# EAGLE design PIC18 DEV BOARD (EAGLE 8.0.1)
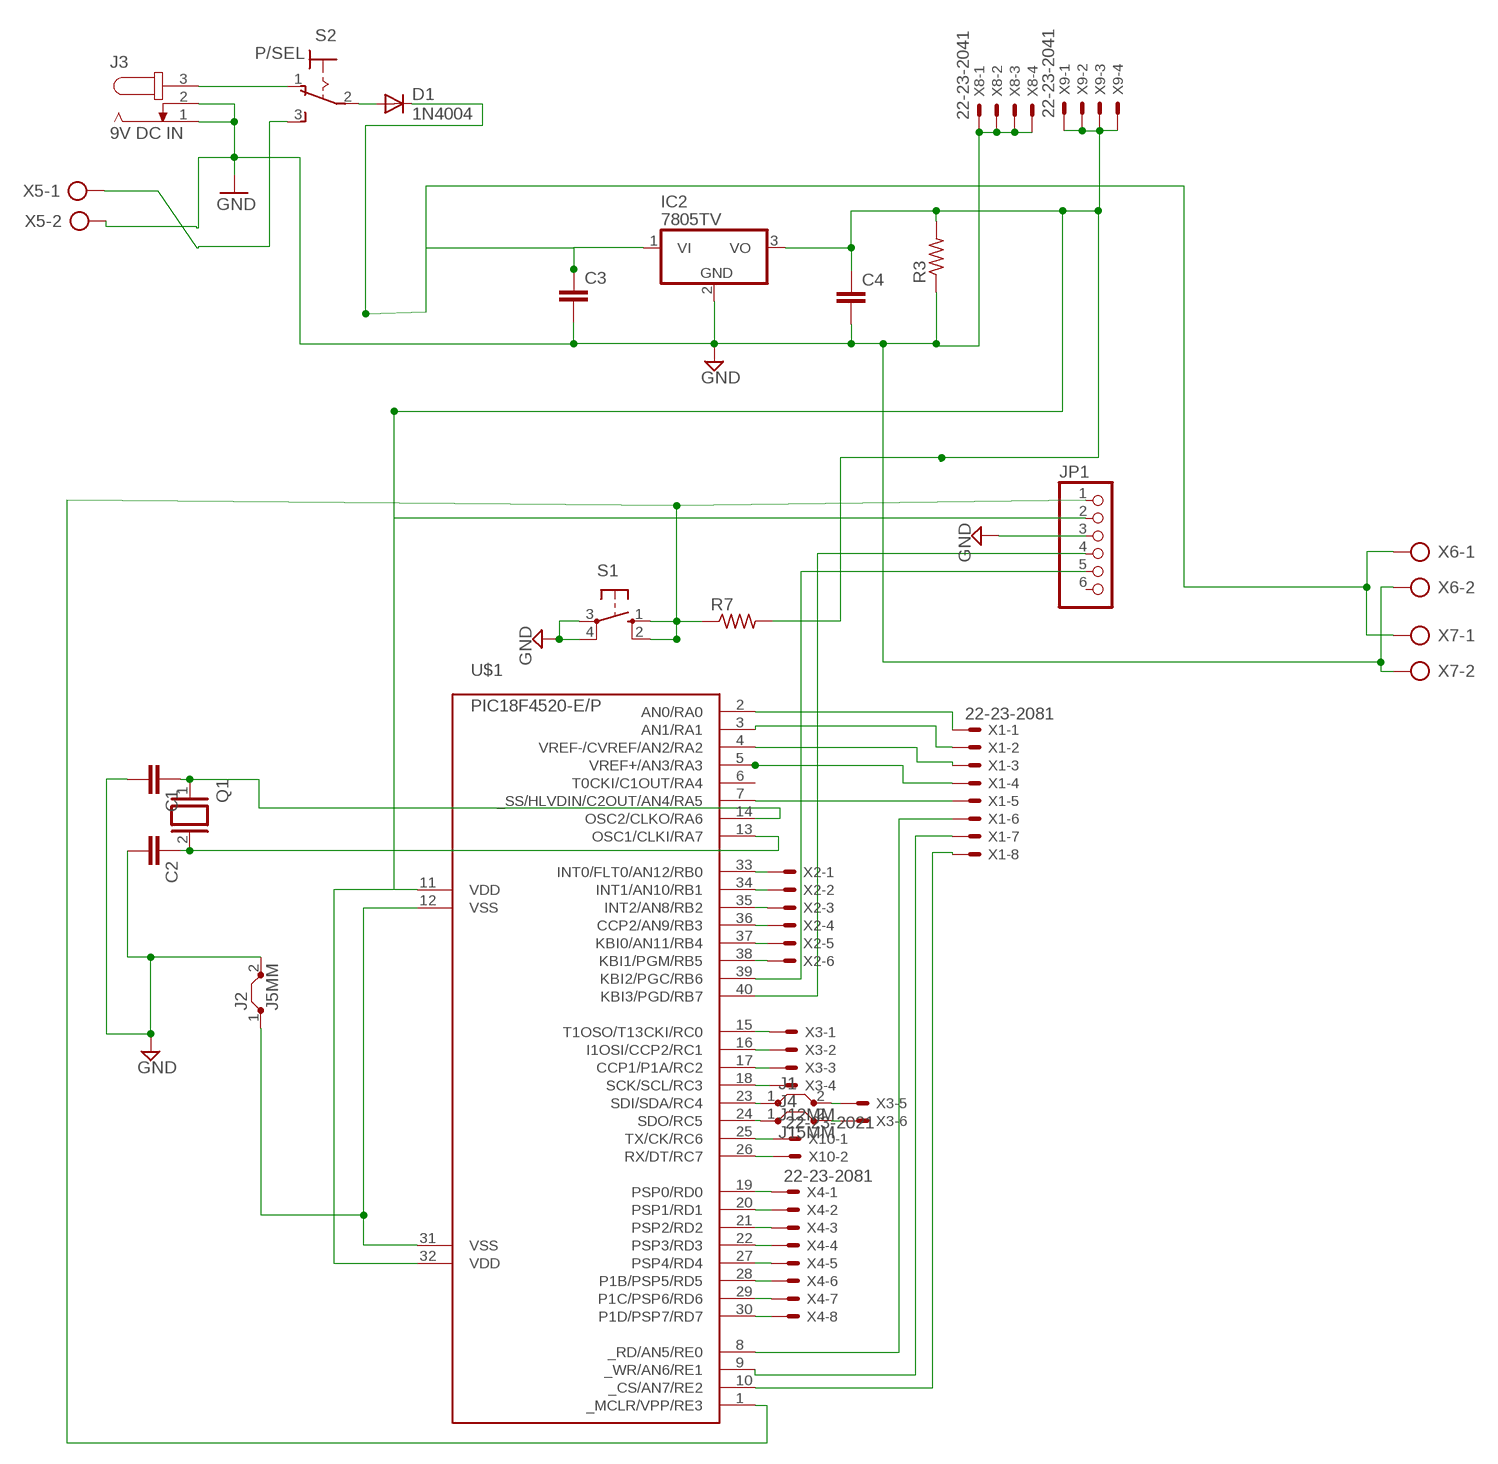
[diagram p0: schematic, sheet 1]

## Parts
C1  C-EU025-025X050  [C025-025X050]
C2  C-EU025-025X050  [C025-025X050]
C3  C-EU025-025X050  [C025-025X050]
C4  C-EU025-025X050  [C025-025X050]
D1  1N4004  [DO41-10]
IC2  7805TV  [TO220V]
J1  J12MM  [12]
J2  J5MM  [05]
J3  9V DC IN  JACK-PLUG0  [SPC4077]
J4  J15MM  [15]
JP1  PINHD-1X6  [1X06]
Q1  XTAL/S  [QS]
R3  R-US_0207/10  [0207/10]
R7  R-US_0207/10  [0207/10]
S1  10-XX  [B3F-10XX]
S2  P/SEL  320-916  [320-916]
U$1  PIC18F4520-E/P  [DIL40]
X1  22-23-2081  [22-23-2081]
X2  22-23-2061  [22-23-2061]
X3  22-23-2061  [22-23-2061]
X4  22-23-2081  [22-23-2081]
X5  AK500/2-H  [AK500/2-H]
X6  AK500/2-H  [AK500/2-H]
X7  AK500/2-H  [AK500/2-H]
X8  22-23-2041  [22-23-2041]
X9  22-23-2041  [22-23-2041]
X10  22-23-2021  [22-23-2021]

## Nets
GND: C1.2 C2.2 C3.2 C4.2 IC2.2(GND) J2.2 J3.1 J3.2 JP1.3 R3.1 S1.3(P) S1.4(P1) X5.2 X6.2 X7.2 X8.1 X8.2 X8.3 X8.4
N$1: JP1.1 R7.1 S1.1(S) S1.2(S1) U$1.1(_MCLR/VPP/RE3)
N$2: U$1.2(AN0/RA0) X1.1
N$3: U$1.3(AN1/RA1) X1.2
N$4: U$1.4(VREF-/CVREF/AN2/RA2) X1.3
N$5: J3.3 S2.1(O)
N$6: U$1.7(_SS/HLVDIN/C2OUT/AN4/RA5) X1.5
N$7: U$1.33(INT0/FLT0/AN12/RB0) X2.1
N$8: U$1.34(INT1/AN10/RB1) X2.2
N$9: U$1.35(INT2/AN8/RB2) X2.3
N$10: U$1.36(CCP2/AN9/RB3) X2.4
N$11: U$1.37(KBI0/AN11/RB4) X2.5
N$12: U$1.38(KBI1/PGM/RB5) X2.6
N$13: U$1.15(T1OSO/T13CKI/RC0) X3.1
N$14: U$1.16(I1OSI/CCP2/RC1) X3.2
N$15: U$1.17(CCP1/P1A/RC2) X3.3
N$16: U$1.18(SCK/SCL/RC3) X3.4
N$17: J1.1 U$1.23(SDI/SDA/RC4)
N$18: J4.1 U$1.24(SDO/RC5)
N$20: U$1.25(TX/CK/RC6) X10.1
N$21: J2.1 U$1.12(VSS) U$1.31(VSS)
N$22: C1.1 Q1.1 U$1.14(OSC2/CLKO/RA6)
N$23: C2.1 Q1.2 U$1.13(OSC1/CLKI/RA7)
N$24: U$1.26(RX/DT/RC7) X10.2
N$25: U$1.19(PSP0/RD0) X4.1
N$26: U$1.20(PSP1/RD1) X4.2
N$27: U$1.21(PSP2/RD2) X4.3
N$28: U$1.22(PSP3/RD3) X4.4
N$29: J1.2 X3.5
N$30: JP1.4 U$1.40(KBI3/PGD/RB7)
N$31: JP1.5 U$1.39(KBI2/PGC/RB6)
N$32: U$1.27(PSP4/RD4) X4.5
N$33: U$1.28(P1B/PSP5/RD5) X4.6
N$34: U$1.29(P1C/PSP6/RD6) X4.7
N$35: U$1.30(P1D/PSP7/RD7) X4.8
N$36: U$1.8(_RD/AN5/RE0) X1.6
N$37: U$1.9(_WR/AN6/RE1) X1.7
N$39: U$1.10(_CS/AN7/RE2) X1.8
N$41: U$1.5(VREF+/AN3/RA3) X1.4
N$42: J4.2 X3.6
N$43: D1.A S2.2(P)
N$44: C3.1 D1.C IC2.1(VI) X6.1 X7.1
N$45: S2.3(S) X5.1
N$47: C4.1 IC2.3(VO) JP1.2 R3.2 R7.2 U$1.11(VDD) U$1.32(VDD) X9.1 X9.2 X9.3 X9.4
Unconnected: JP1.6 U$1.6(T0CKI/C1OUT/RA4)

## Library data of the parts
C1-C4 = resistor:C-EU: CAPACITOR, European symbol
D1 = diode:1N4004: DIODE general purpose rectifier, 1 A; MF: MULTICOMP; MPN: 1N4004; OC_FARNELL: 9565027
IC2 = linear:78*: Positive VOLTAGE REGULATOR Source: http://cache.national.com/ds/LM/LM78L05.pdf http://www.fairchildsemi.com/ds/LM/LM7805.pdf
J1 J2 J4 = jumper:J: Bridge
J3 = con-jack:JACK-PLUG: DC POWER JACK Power Jack, DC, Right Angle, Through Hole, Rated 5A at 16VDC, PC Terminals Distributor: Farnell (www.Farnell.de) Drawing: 84N1161.pdf / 84N1162.pdf Manufacturer: SPC Technology (www.spctechnology.com) Type: SPC4077 / SPC 4078; MF: SWITCHCRAFT; MPN: RAPC722X; OC_FARNELL: 1608727; OC_NEWARK: unknown
JP1 = pinhead:PINHD-1X6: PIN HEADER
Q1 = special:XTAL/S: CRYSTAL
R3 R7 = resistor:R-US_: RESISTOR, American symbol
S1 = switch-omron:10-XX: OMRON SWITCH; MPN: B3F-1000; OC_FARNELL: 176432; OC_NEWARK: 36M3542
S2 = switch:320-916: TOGGLE SWITCH distributor RS Components; MF: APEM; MPN: 5636A9; OC_FARNELL: 1082301
U$1 = pic18fxx20:PIC18*4520: PIC18*4520 Microchip FLASH Microcontroller with A/D DEVICE FEATURES Feature PIC18*4520 Program Memory (bytes) 32768 Program Memory (instructions) 16384 Interupt Sources 20 I/O Ports Ports A, B, C, D, E Capture/Compare/PWM Modules 1 Enhanced Capture/Compare/PWM Modules 1 Parallel Communications (PSP) Yes 10-bit Analog-to-Digital Module 13 input Channels Package Types 40-pin PDIP 44-pin TQFP 44-pin QFN NOTES: F only after 18, means standard voltage range from 4.2v to 5.5v LF after 18, means extended voltage range from 2.0v to 5.5v -E before / denotes extended temperature range from -40°C to +120°C -I before / denotes industrial temperature range from -40°C to +85°C /PT suffix denotes TQFP package /SO suffix denotes SOIC package /SP suffix denotes Skinny Plastic DIP package /P suffix denotes Plastic DIP package /ML suffix denotes QFN package
X1 X4 = con-molex:22-23-2081: .100" (2.54mm) Center Header - 8 Pin; MF: MOLEX; MPN: 22-23-2081; OC_FARNELL: 1756826; OC_NEWARK: 01C7592
X2 X3 = con-molex:22-23-2061: .100" (2.54mm) Center Header - 6 Pin; MF: MOLEX; MPN: 22-23-2061; OC_FARNELL: 1462922; OC_NEWARK: 27C1933
X5-X7 = con-ptr500:AK500/2-H: CONNECTOR Aug. 2004 / PTR Meßtechnik: Die Bezeichnung der Serie AK505 wurde geändert. Es handelt sich hierbei um AK500 in horizontaler Ausführung.; OC_FARNELL: unknown; OC_NEWARK: unknown
X8 X9 = con-molex:22-23-2041: .100" (2.54mm) Center Header - 4 Pin; MF: MOLEX; MPN: 22-23-2041; OC_FARNELL: 1462920; OC_NEWARK: 38C0355
X10 = con-molex:22-23-2021: .100" (2.54mm) Center Header - 2 Pin; MF: MOLEX; MPN: 22-23-2021; OC_FARNELL: 1462926; OC_NEWARK: 25C3832

## Board
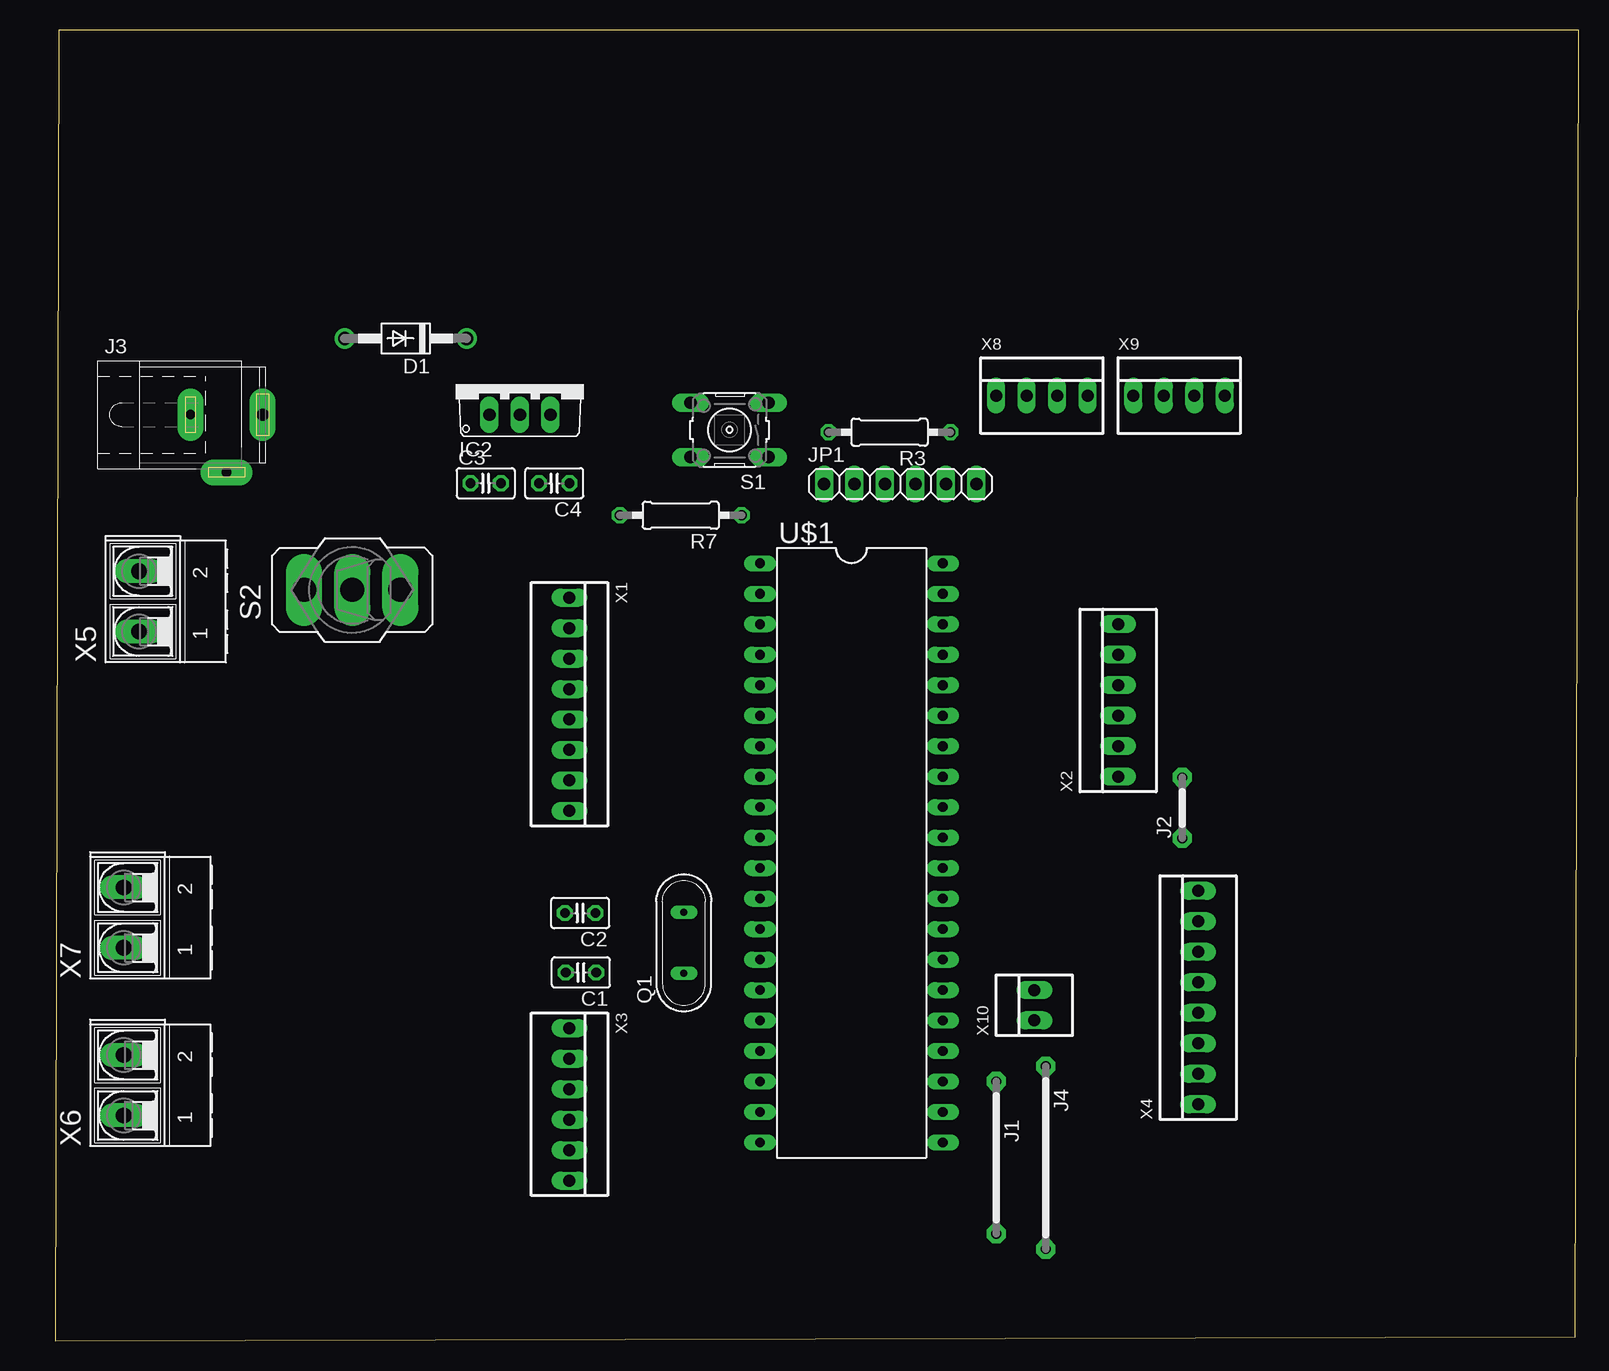
[diagram p1: board, top side]
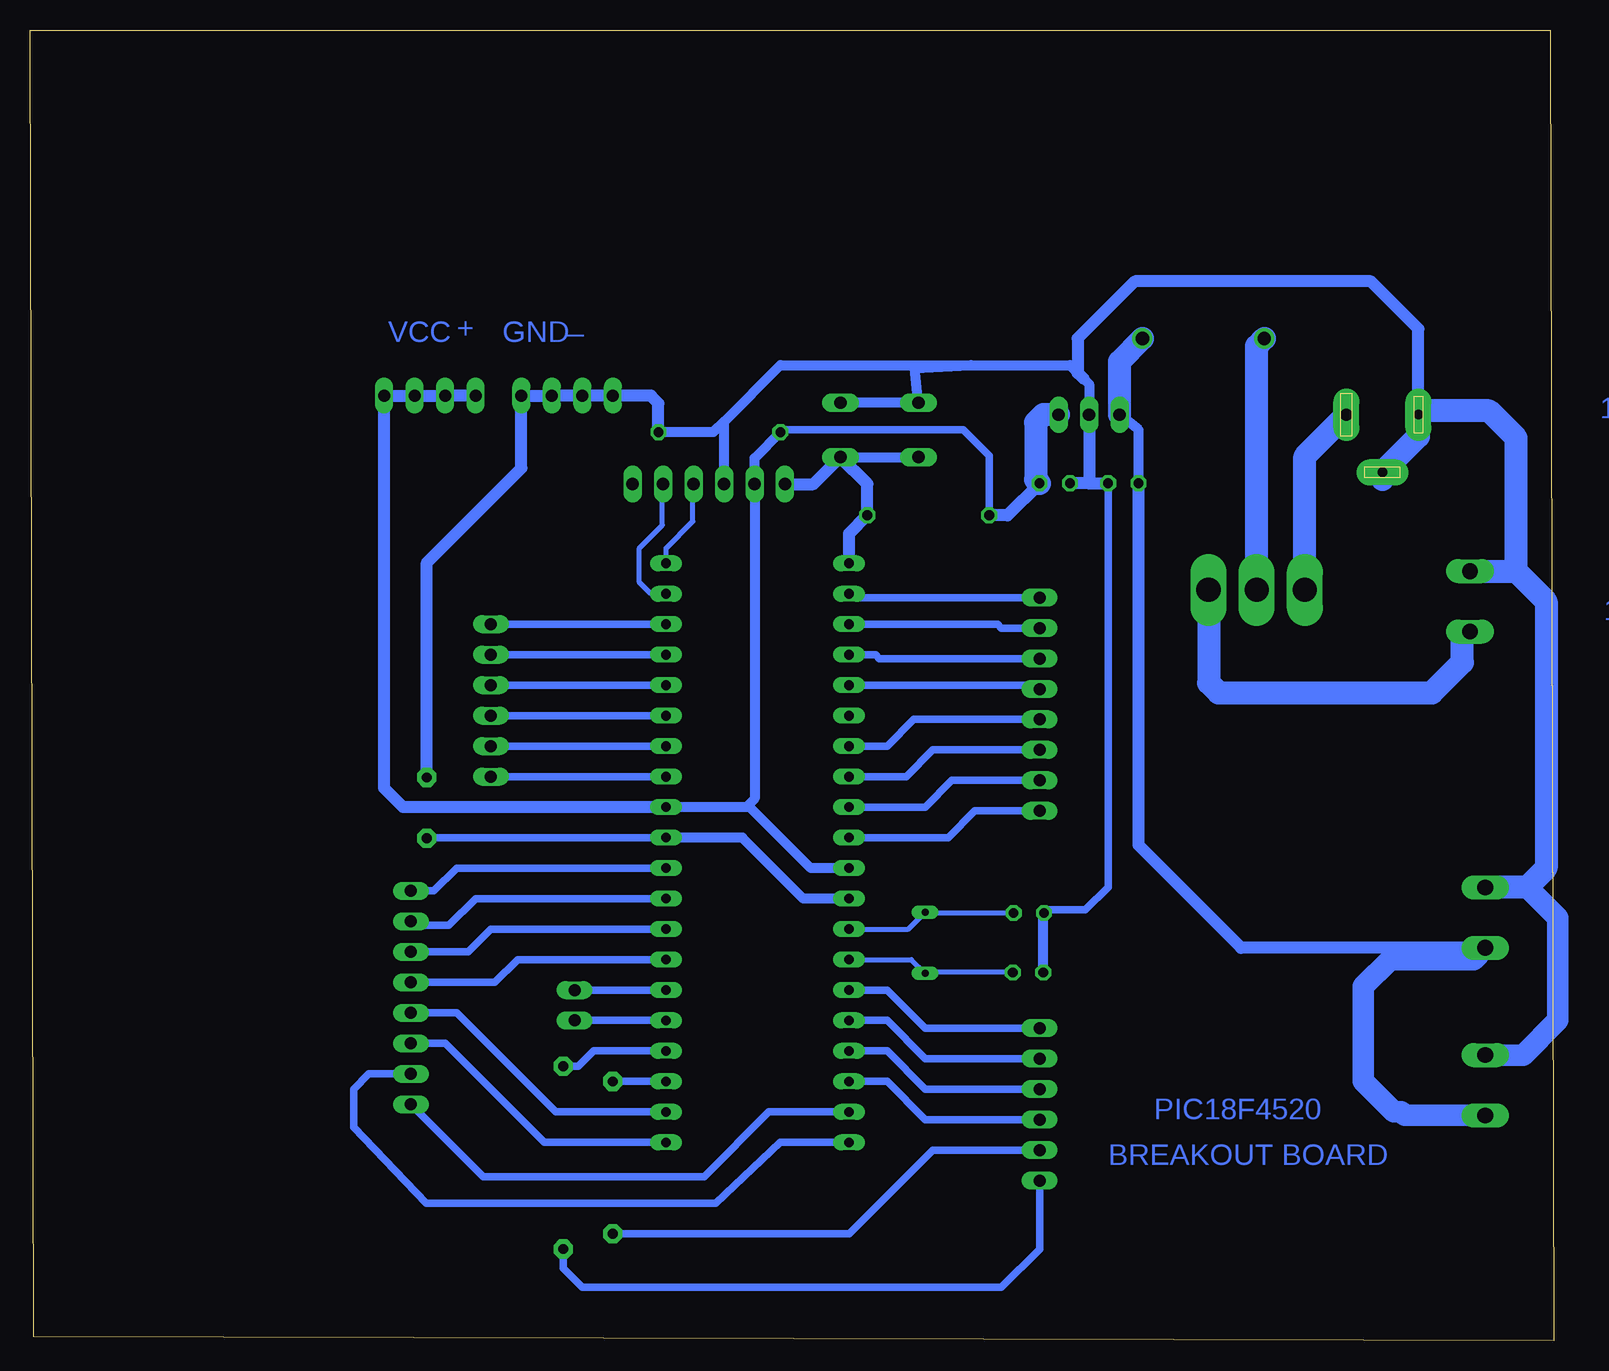
[diagram p2: board, bottom side, seen from below]

Size 126.99 x 109.21 mm. Coordinates in mm from the lower left corner, seen from the top.
Outline: 0,0 126.67,0.32 126.99,109.21 0.32,109.21 0,0
Copper layers (1*16): Top 0.035mm / dielectric 1.5mm / Bottom 0.035mm
Design rules "default": minimum track width 10mil, minimum drill 24mil, track to track 8mil, track to pad 8mil, pad to pad 8mil, via to via 8mil, smd to smd 8mil, copper to edge 40mil, drill to drill 8mil, minimum pad ring 10mil, minimum via ring 8mil, stop-mask expansion 4mil, vias tented up to drill 0mil, thermal gap 10mil

### Footprints (pad centres in the part's own frame; a part is rotated, then mirrored left to right if it is on the bottom)
C025-025X050 = drill 0.813 octagon: 1 -1.27,0; 2 1.27,0
DO41-10 = drill 1.118: A 5.08,0; C -5.08,0
TO220V = drill 1.016 long: 1 -2.54,-2.54; 2 0,-2.54; 3 2.54,-2.54
12 = drill 0.813 pad 1.6 octagon: 1 -6.35,0; 2 6.35,0
05 = drill 0.813 pad 1.6 octagon: 1 -2.54,0; 2 2.54,0
SPC4077 = drill 0.8 pad 2.184 long: 1 -3,0; 2 0,-4.8 | drill 1 pad 2.184 long: 3 3,0
15 = drill 0.813 pad 1.6 octagon: 1 -7.62,0; 2 7.62,0
1X06 = drill 1.016 long: 1 -6.35,0; 2 -3.81,0; 3 -1.27,0; 4 1.27,0; 5 3.81,0; 6 6.35,0
QS = drill 0.61 long: 1 -2.54,0; 2 2.54,0
0207/10 = drill 0.813 octagon: 1 -5.08,0; 2 5.08,0
B3F-10XX = drill 1.016 long: 1 -3.251,2.261; 2 3.251,2.261; 3 -3.251,-2.261; 4 3.251,-2.261
320-916 = drill 2.007 long: 1 0,4.013; 2 0,0; 3 0,-4.013
DIL40 = drill 0.813 long: 1 -24.13,-7.62; 2 -21.59,-7.62; 3 -19.05,-7.62; 4 -16.51,-7.62; 5 -13.97,-7.62; 6 -11.43,-7.62; 7 -8.89,-7.62; 8 -6.35,-7.62; 9 -3.81,-7.62; 10 -1.27,-7.62; 11 1.27,-7.62; 12 3.81,-7.62; 13 6.35,-7.62; 14 8.89,-7.62; 15 11.43,-7.62; 16 13.97,-7.62; 17 16.51,-7.62; 18 19.05,-7.62; 19 21.59,-7.62; 20 24.13,-7.62; 21 24.13,7.62; 22 21.59,7.62; 23 19.05,7.62; 24 16.51,7.62; 25 13.97,7.62; 26 11.43,7.62; 27 8.89,7.62; 28 6.35,7.62; 29 3.81,7.62; 30 1.27,7.62; 31 -1.27,7.62; 32 -3.81,7.62; 33 -6.35,7.62; 34 -8.89,7.62; 35 -11.43,7.62; 36 -13.97,7.62; 37 -16.51,7.62; 38 -19.05,7.62; 39 -21.59,7.62; 40 -24.13,7.62
22-23-2081 = drill 1 long: 1 -8.89,0; 2 -6.35,0; 3 -3.81,0; 4 -1.27,0; 5 1.27,0; 6 3.81,0; 7 6.35,0; 8 8.89,0
22-23-2061 = drill 1 long: 1 -6.35,0; 2 -3.81,0; 3 -1.27,0; 4 1.27,0; 5 3.81,0; 6 6.35,0
AK500/2-H = drill 1.321 long: 1 -2.515,0; 2 2.515,0
22-23-2041 = drill 1 long: 1 -3.81,0; 2 -1.27,0; 3 1.27,0; 4 3.81,0
22-23-2021 = drill 1 long: 1 -1.27,0; 2 1.27,0

### Placement (x,y rotation side)
C1  43.81,30.67 180 top
C2  43.75,35.62 180 top
C3  35.88,71.44 0 top
C4  41.59,71.44 180 top
D1  29.21,83.5 180 top
IC2  38.73,79.69 0 top
J1  78.42,15.24 270 top
J2  93.92,44.39 90 top
J3  14.29,77.15 0 top
J4  82.55,15.24 270 top
JP1  70.42,71.37 0 top
Q1  52.39,33.15 90 top
R3  69.53,75.69 180 top
R7  52.13,68.77 180 top
S1  56.2,75.88 180 top
S2  24.77,62.55 90 top
U$1  66.36,40.64 270 top
X1  42.86,53.02 270 top
X2  88.58,53.34 90 top
X3  42.86,19.69 270 top
X4  95.25,28.57 90 top
X5  6.98,61.59 90 top
X6  5.71,21.27 90 top
X7  5.71,35.24 90 top
X8  82.23,78.74 0 top
X9  93.66,78.74 0 top
X10  81.6,27.94 90 top

### Tracks (layer width: path | path; a pad name or v marks a point on that pad's centre or on a via)
GND
  Bottom 0.406: C2.2 42.55,35.24
  Bottom 0.61: C4.2 C3.2 37.15,37.78 39.05,35.88 42.23,35.88 C2.2
  Bottom 0.813: S1.3 S1.4 53.26,81.04 48.58,81.28 | C1.2 42.55,35.24 | R3.1 70.04,75.69 69.15,76.58 | JP1.3 69.15,76.58 | 69.15,76.58 64.45,81.28 48.58,81.28 | 48.58,81.28 40.32,81.28 39.21,80.17 38.74,79.69 IC2.2
  Bottom 1.016: 38.74,71.44 C3.2 | 38.74,71.44 C4.2 | IC2.2 38.74,71.44 | R3.1 74.61,78.1 75.25,78.74 X8.1 X8.2 X8.3 X8.4 86.04,72.71 93.92,64.83 J2.2 | J3.1 11.29,84.31 15.24,88.26 34.92,88.26 39.69,83.5 39.69,80.65 39.21,80.17
  Bottom 1.778: X6.2 2.57,23.79 -0.32,26.67 -0.32,35.24 2.22,37.78
  Bottom 1.93: X5.2 3.15,64.11 | 3.15,64.11 0.64,61.59 0.64,39.37 2.22,37.78 5.69,37.78 X7.2 | 14.29,71.75 J3.2 11.29,75.35 J3.1 10.97,77.47 5.4,77.47 3.15,75.22 3.15,64.11
N$1
  Bottom 0.813: S1.1 S1.2
  Bottom 1.016: 57.21,71.39 R7.1 58.74,67.25 U$1.1 | 57.21,71.39 S1.1 | S1.1 57.21,71.39 | JP1.1 61.7,71.37 S1.1
N$2
  Bottom 0.61: X1.1 58.42,61.91 U$1.2
N$3
  Bottom 0.61: U$1.3 46.35,59.69 46.04,59.37 X1.2
N$4
  Bottom 0.61: X1.3 56.2,56.83 56.51,57.15 U$1.4
N$5
  Bottom 1.93: S2.1 20.75,73.69 J3.3
N$6
  Bottom 0.61: X1.5 53.34,51.75 55.56,49.53 U$1.7
N$7
  Bottom 0.61: U$1.33 X2.1
N$8
  Bottom 0.61: X2.2 U$1.34
N$9
  Bottom 0.61: U$1.35 X2.3
N$10
  Bottom 0.61: X2.4 U$1.36
N$11
  Bottom 0.61: U$1.37 X2.5
N$12
  Bottom 0.61: U$1.38 X2.6
N$13
  Bottom 0.61: X3.1 52.39,26.04 55.56,29.21 U$1.15
N$14
  Bottom 0.61: X3.2 52.39,23.49 55.56,26.67 U$1.16
N$15
  Bottom 0.61: X3.3 52.39,20.95 55.56,24.13 U$1.17
N$16
  Bottom 0.61: X3.4 52.39,18.41 55.56,21.59 U$1.18
N$17
  Bottom 0.61: U$1.23 J1.1
N$18
  Bottom 0.61: U$1.24 80.01,24.13 81.28,22.86 J4.1
N$20
  Bottom 0.61: X10.1 U$1.25
N$21
  Bottom 0.61: U$1.31 93.85,41.91 J2.1
  Bottom 0.813: U$1.31 67.63,41.91 62.55,36.83 U$1.12
N$22
  Bottom 0.406: U$1.14 53.53,31.75 Q1.1 52.32,30.67 C1.1
N$23
  Bottom 0.406: U$1.13 53.78,34.29 Q1.2 52.32,35.62 C2.1
N$24
  Bottom 0.61: U$1.26 X10.2
N$25
  Bottom 0.61: 59.37,19.05 U$1.19 65.41,19.05 70.8,13.65 89.22,13.65 X4.1
N$26
  Bottom 0.61: U$1.20 64.45,16.51 69.85,11.43 93.98,11.43 100.01,17.78 100.01,20.95 98.74,22.23 X4.2
N$27
  Bottom 0.61: U$1.21 84.14,16.51 92.39,24.77 X4.3
N$28
  Bottom 0.61: X4.4 91.44,27.3 83.19,19.05 U$1.22
N$29
  Bottom 0.61: X3.5 51.75,15.88 58.74,8.89 J1.2
N$30
  Bottom 0.406: U$1.40 73.98,66.04 71.76,68.26 71.76,71.31 JP1.4
N$31
  Bottom 0.406: U$1.39 75.25,62.23 76.2,63.18 76.2,66.04 74.3,67.94 74.3,71.31 JP1.5
N$32
  Bottom 0.61: U$1.27 86.36,31.75 88.26,29.84 X4.5
N$33
  Bottom 0.61: U$1.28 88.58,34.29 90.49,32.38 X4.6
N$34
  Bottom 0.61: U$1.29 89.85,36.83 92.08,34.61 95.57,34.61 95.89,34.92 X4.7
N$35
  Bottom 0.61: X4.8 93.34,37.47 91.44,39.37 U$1.30
N$36
  Bottom 0.61: X1.6 51.75,49.21 53.98,46.99 U$1.8
N$37
  Bottom 0.61: X1.7 50.17,46.67 52.39,44.45 U$1.9
N$39
  Bottom 0.61: X1.8 48.26,44.13 50.48,41.91 U$1.10
N$41
  Bottom 0.61: U$1.5 43.18,54.61 X1.4
N$42
  Bottom 0.61: X3.6 42.86,7.62 46.04,4.44 80.96,4.44 82.55,6.03 J4.2
N$43
  Bottom 0.61: 24.76,63.18 S2.2
  Bottom 1.016: S2.2 24.76,62.23 24.45,61.91
  Bottom 1.93: S2.2 24.76,82.87 D1.A
N$44
  Bottom 0.813: C3.1 34.61,75.88 IC2.1
  Bottom 1.016: X7.1 26.06,32.73 34.61,41.27 C3.1
  Bottom 1.778: X6.1 12.41,18.76 12.7,19.05 13.33,19.05 15.88,21.59 15.88,29.53 13.65,31.75 6.69,31.75 X7.1
  Bottom 1.93: IC2.1 36.19,81.6 D1.C
N$45
  Bottom 1.93: S2.3 28.78,54.81 27.94,53.98 10.16,53.98 7.62,56.52 7.62,58.45 X5.1
N$47
  Bottom 0.61: R7.2 47.05,73.72 49.21,75.88 64.26,75.88 R3.2
  Bottom 0.813: U$1.11 61.91,39.37 66.99,44.45 67.31,44.45 | 67.31,44.45 U$1.32 | 67.31,44.45 66.61,45.15 JP1.2 66.61,73.53 R3.2
  Bottom 1.016: X9.1 X9.2 X9.3 X9.4 97.47,46.04 95.89,44.45 U$1.32 | R7.2 45.53,68.77 C4.1
  Bottom 1.93: IC2.3 42.55,77.15 43.18,76.52 43.18,71.75 C4.1

### Text on the board
Bottom: _ | GND | + | VCC | 12V DC | 12V DC | _ | + | 12V DC | _ | + | 12V DC | _ | PIC18F4520 | + | BREAKOUT BOARD